# Altium schematic sheet BMS_CAN.SchDoc
size A
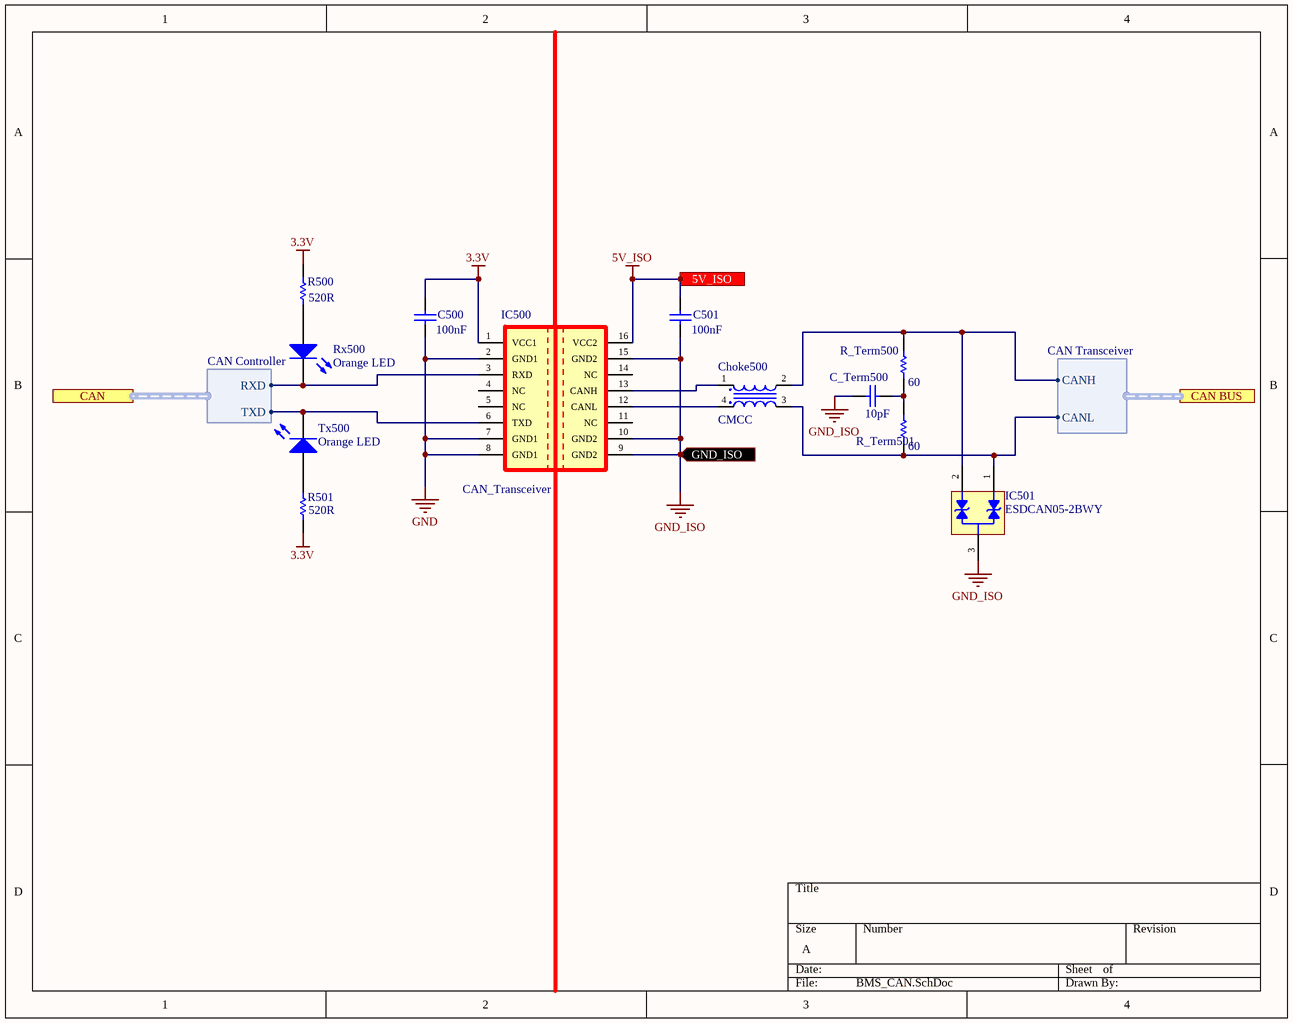
[diagram p0: BMS_CAN.SchDoc]

## Parts
C500  value 100nF  [CAPC2012X14N]  (hidden comment: Cap)
C501  value 100nF  [CAPC2012X14N]  (hidden comment: Cap)
C_Term500  value 10pF  [CAPC2012X14N]  (hidden comment: Cap)
Choke500  CMCC  [DLW32SH101XK2L]
IC500  CAN_Transceiver  [SOIC127P1030X265-16N]
IC501  ESDCAN05-2BWY  [SOT70P210X110-3N]
R500  value 520R  [RESC2012X07N]  (hidden comment: Res1)
R501  value 520R  [RESC2012X07N]  (hidden comment: Res1)
R_Term500  value 60  [RESC2012X07N]  (hidden comment: Res1)
R_Term501  value 60  [RESC2012X07N]  (hidden comment: Res1)
Rx500  Orange LED  [SMD ORANGE LED]
Tx500  Orange LED  [SMD ORANGE LED]

## Ports
5V_ISO (in), CAN (harness CAN Controller), CAN BUS (harness CAN Transceiver), GND_ISO (in)

## Harnesses
CAN Controller: TXD, RXD
CAN Transceiver: CANH, CANL

## Nets
3.3V: C500.2 IC500.1(VCC1) R500.2 R501.2
5V_ISO: C501.2 IC500.16(VCC2) ; port 5V_ISO
GND: C500.1 IC500.2(GND1) IC500.7(GND1) IC500.8(GND1)
GND_ISO: C501.1 C_Term500.2 IC500.9(GND2) IC500.10(GND2) IC500.15(GND2) IC501.3 ; port GND_ISO
NetC_Term500_1: C_Term500.1 R_Term500.1 R_Term501.2
NetChoke500_1: Choke500.1 IC500.13(CANH)
NetChoke500_2: Choke500.2 IC501.2 R_Term500.2 ; port CAN BUS.CANH
NetChoke500_3: Choke500.3 IC501.1 R_Term501.1 ; port CAN BUS.CANL
NetChoke500_4: Choke500.4 IC500.12(CANL)
NetIC500_3: IC500.3(RXD) Rx500.2(K) ; port CAN.RXD
NetIC500_6: IC500.6(TXD) Tx500.2(K) ; port CAN.TXD
NetR500_1: R500.1 Rx500.1(A)
NetR501_1: R501.1 Tx500.1(A)

Not connected (* = marked no-connect by the designer): IC500 4(NC) 5(NC) 11(NC) 14(NC)

## Library data of the parts
C500 C501 C_Term500 = Cap: Capacitor; Published: 8-Jun-2000; LatestRevisionDate: 17-Jul-2002; LatestRevisionNote: Re-released for DXP Platform.; PackageReference: RAD-0.3; Publisher: Altium Limited; PackageDescription: Radial Cap, Thru-Hole; 2 Leads; 0.3 in Pin Spacing
Choke500 = DLW32SH101XK2L: Common Mode Chokes / Filters 1210 80VDC 100uH 150mA AEC-Q200
IC500 = ISO1050DWR: Digital Isolators Isolated 5V CAN Xcvr
IC501 = ESDCAN05-2BWY: Automotive dual-line TVS in SOT323-3L for CAN bus
R500 R501 R_Term500 R_Term501 = Res1: Resistor; Published: 8-Jun-2000; LatestRevisionDate: 17-Jul-2002; LatestRevisionNote: Re-released for DXP Platform.; PackageReference: AXIAL-0.3; Publisher: Altium Limited; PackageDescription: Axial Device, Thru-Hole; 2 Leads; 0.3 in Pin Spacing
Rx500 Tx500 = LED0: Typical INFRARED GaAs LED; Published: 8-Jun-2000; LatestRevisionDate: 08-Jul-2005; LatestRevisionNote: Mech Layer 1 removed.; PackageReference: LED-0; Publisher: Altium Limited; PackageDescription: LED; 2 Leads